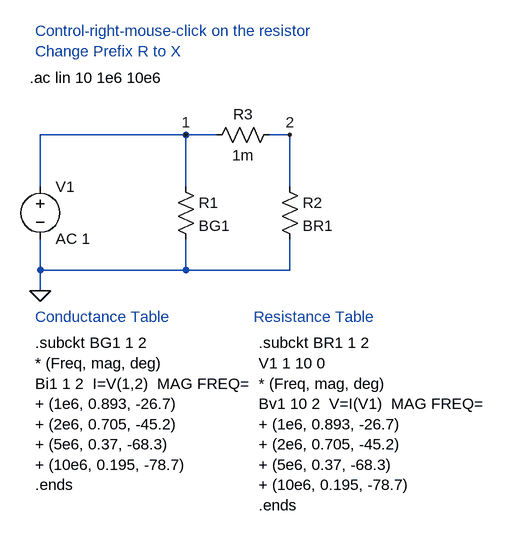
[diagram p0: schematic ac_resistance_conductance.asc]
ac_resistance_conductance.asc, the LTspice schematic file:
Version 4
SHEET 1 996 680
WIRE 256 32 32 32
WIRE 304 32 256 32
WIRE 416 32 384 32
WIRE 32 112 32 32
WIRE 256 112 256 32
WIRE 416 112 416 32
WIRE 32 240 32 192
WIRE 256 240 256 192
WIRE 256 240 32 240
WIRE 416 240 416 192
WIRE 416 240 256 240
WIRE 32 272 32 240
FLAG 32 272 0
FLAG 256 32 1
FLAG 416 32 2
SYMBOL res 240 96 R0
SYMATTR InstName R1
SYMATTR Value BG1
SYMATTR Prefix X
SYMBOL voltage 32 96 R0
SYMATTR InstName V1
SYMATTR Value AC 1
SYMBOL res 400 96 R0
SYMATTR InstName R2
SYMATTR Value BR1
SYMATTR Prefix X
SYMBOL res 288 48 R270
WINDOW 0 32 56 VTop 0
WINDOW 3 0 56 VBottom 0
SYMATTR InstName R3
SYMATTR Value 1m
TEXT 24 352 Left 0 !.subckt BG1 1 2 \n* (Freq, mag, deg)\nBi1 1 2  I=V(1,2)  MAG FREQ=\n+ (1e6, 0.893, -26.7)\n+ (2e6, 0.705, -45.2)\n+ (5e6, 0.37, -68.3)\n+ (10e6, 0.195, -78.7)\n.ends
TEXT 16 -56 Left 0 !.ac lin 10 1e6 10e6
TEXT 368 352 Left 0 !.subckt BR1 1 2 \nV1 1 10 0\n* (Freq, mag, deg)\nBv1 10 2  V=I(V1)  MAG FREQ=\n+ (1e6, 0.893, -26.7)\n+ (2e6, 0.705, -45.2)\n+ (5e6, 0.37, -68.3)\n+ (10e6, 0.195, -78.7)\n.ends
TEXT 24 312 Left 0 ;Conductance Table
TEXT 360 312 Left 0 ;Resistance Table
TEXT 24 -128 Left 0 ;Control-right-mouse-click on the resistor\nChange Prefix R to X

The netlist it stands for:
* ac_resistance_conductance.asc
XR1 1 0 BG1  ; pins A B
V1 1 0 AC 1
XR2 2 0 BR1  ; pins A B
R3 1 2 1m
.subckt BG1 1 2
* (Freq, mag, deg)
Bi1 1 2  I=V(1,2)  MAG FREQ=
+ (1e6, 0.893, -26.7)
+ (2e6, 0.705, -45.2)
+ (5e6, 0.37, -68.3)
+ (10e6, 0.195, -78.7)
.ends
.ac lin 10 1e6 10e6
.subckt BR1 1 2
V1 1 10 0
* (Freq, mag, deg)
Bv1 10 2  V=I(V1)  MAG FREQ=
+ (1e6, 0.893, -26.7)
+ (2e6, 0.705, -45.2)
+ (5e6, 0.37, -68.3)
+ (10e6, 0.195, -78.7)
.ends
* Conductance Table
* Resistance Table
* Control-right-mouse-click on the resistor
* Change Prefix R to X
.backanno
.end